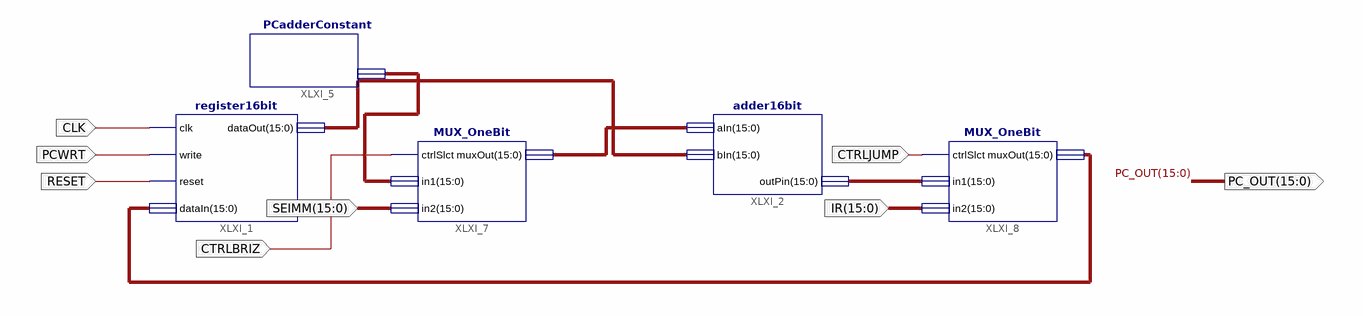
[diagram p0: schematic sheet 1]
// Xilinx ISE schematic PCAdderMuxes_Schematic.sch (spartan3e) as structural Verilog: 5 symbols, 8 ports
module PCAdderMuxes_Schematic (
  input  CLK,
  input  PCWRT,
  input  RESET,
  input  [15:0] SEIMM,
  input  [15:0] IR,
  input  CTRLBRIZ,
  input  CTRLJUMP,
  output [15:0] PC_OUT
);

  wire [15:0] XLXN_19, XLXN_21, XLXN_22, XLXN_27;

  register16bit XLXI_1 (.clk(CLK), .write(PCWRT), .reset(RESET), .dataIn(XLXN_27), .dataOut(PC_OUT));
  adder16bit XLXI_2 (.aIn(XLXN_21), .bIn(PC_OUT), .outPin(XLXN_22));
  PCadderConstant XLXI_5 (.constantOne(XLXN_19));
  MUX_OneBit XLXI_7 (.ctrlSlct(CTRLBRIZ), .in1(XLXN_19), .in2(SEIMM), .muxOut(XLXN_21));
  MUX_OneBit XLXI_8 (.ctrlSlct(CTRLJUMP), .in1(XLXN_22), .in2(IR), .muxOut(XLXN_27));
endmodule
